# Altium schematic sheet TFT-Display.SchDoc
size A; SheetNumber: 9; SheetTotal: 15
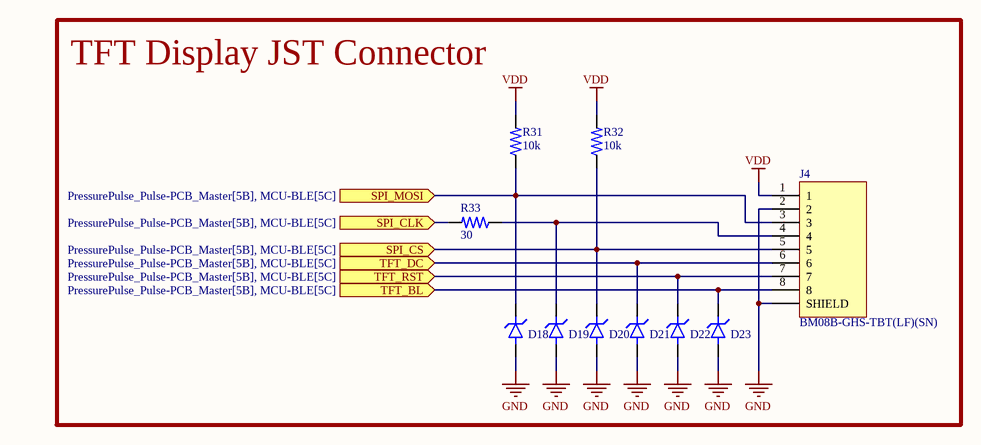
[diagram p0: TFT-Display.SchDoc]

## Parts
D18  BDFN2C051V40  [BDFN2C051V40]  (value not drawn)
D19  BDFN2C051V40  [BDFN2C051V40]  (value not drawn)
D20  BDFN2C051V40  [BDFN2C051V40]  (value not drawn)
D21  BDFN2C051V40  [BDFN2C051V40]  (value not drawn)
D22  BDFN2C051V40  [BDFN2C051V40]  (value not drawn)
D23  BDFN2C051V40  [BDFN2C051V40]  (value not drawn)
J4  BM08B-GHS-TBT(LF)(SN)  [JST_BM08B-GHS-TBT(LF)(SN)(N)]
R31  value 10k  [0402R]  (hidden comment: RES)
R32  value 10k  [0402R]  (hidden comment: RES)
R33  value 30  [0402R]  (hidden comment: RES)

## Blocks framed on the sheet
TFT Display JST Connector: D18-D23 J4 R31-R33

## Ports
SPI_CLK (in, see PressurePulse_Pulse-PCB_Master[5B], MCU-BLE[5C]), SPI_CS (in, see PressurePulse_Pulse-PCB_Master[5B], MCU-BLE[5C]), SPI_MOSI (in, see PressurePulse_Pulse-PCB_Master[5B], MCU-BLE[5C]), TFT_BL (in, see PressurePulse_Pulse-PCB_Master[5B], MCU-BLE[5C]), TFT_DC (in, see PressurePulse_Pulse-PCB_Master[5B], MCU-BLE[5C]), TFT_RST (in, see PressurePulse_Pulse-PCB_Master[5B], MCU-BLE[5C])

## Nets
GND: D18.A D19.A D20.A D21.A D22.A D23.A J4.2 J4.SHIELD
VDD: J4.1 R31.2 R32.2
SPI_CLK: R33.2 ; port SPI_CLK
SPI_CS: D20.K J4.5 R32.1 ; port SPI_CS
SPI_MOSI: D18.K J4.3 R31.1 ; port SPI_MOSI
TFT_BL: D23.K J4.8 ; port TFT_BL
TFT_DC: D21.K J4.6 ; port TFT_DC
TFT_RST: D22.K J4.7 ; port TFT_RST
NetD19_K: D19.K J4.4 R33.1

## Library data of the parts
D18-D23 = TVS DIODE: 25V Clamp 4A (8/20µs) Ipp Tvs Diode Surface Mount SLP1006P2; MFR: BORN; Type: SMD; MFR PN: BDFN2C051V40; Value: BDFN2C051V40; JLCPCB PN: C152023
J4 = JST CONN 8POS GH: Connector Header Surface Mount 8 position 0.049 _1.25mm_; MFR: JST Sales; Value: BM08B-GHS-TBT(LF)(SN); MFR PN: BM08B-GHS-TBT(LF)(SN); JLCPCB PN: C133062
R31-R33 = RES: Resistor; MFR PN: *; MFR: *; JLCPCB PN: *